# Altium schematic sheet P04_BCS1_Core Connector.SchDoc
size A3; Date: 24.11.2011; CheckedBy: Finke; Author: Mierau; DrawnBy: Mierau; SheetNumber: 4; SheetTotal: 8; Anlage: 78; Beschreibung: Qseven; Kunde: 56; ProjektName: BCS1; ProjektNummer: 88xxx; Ersatz_fuer: 12; ersetzt_durch: 34; LKNummer: 6190202; ID_Nummer: 90
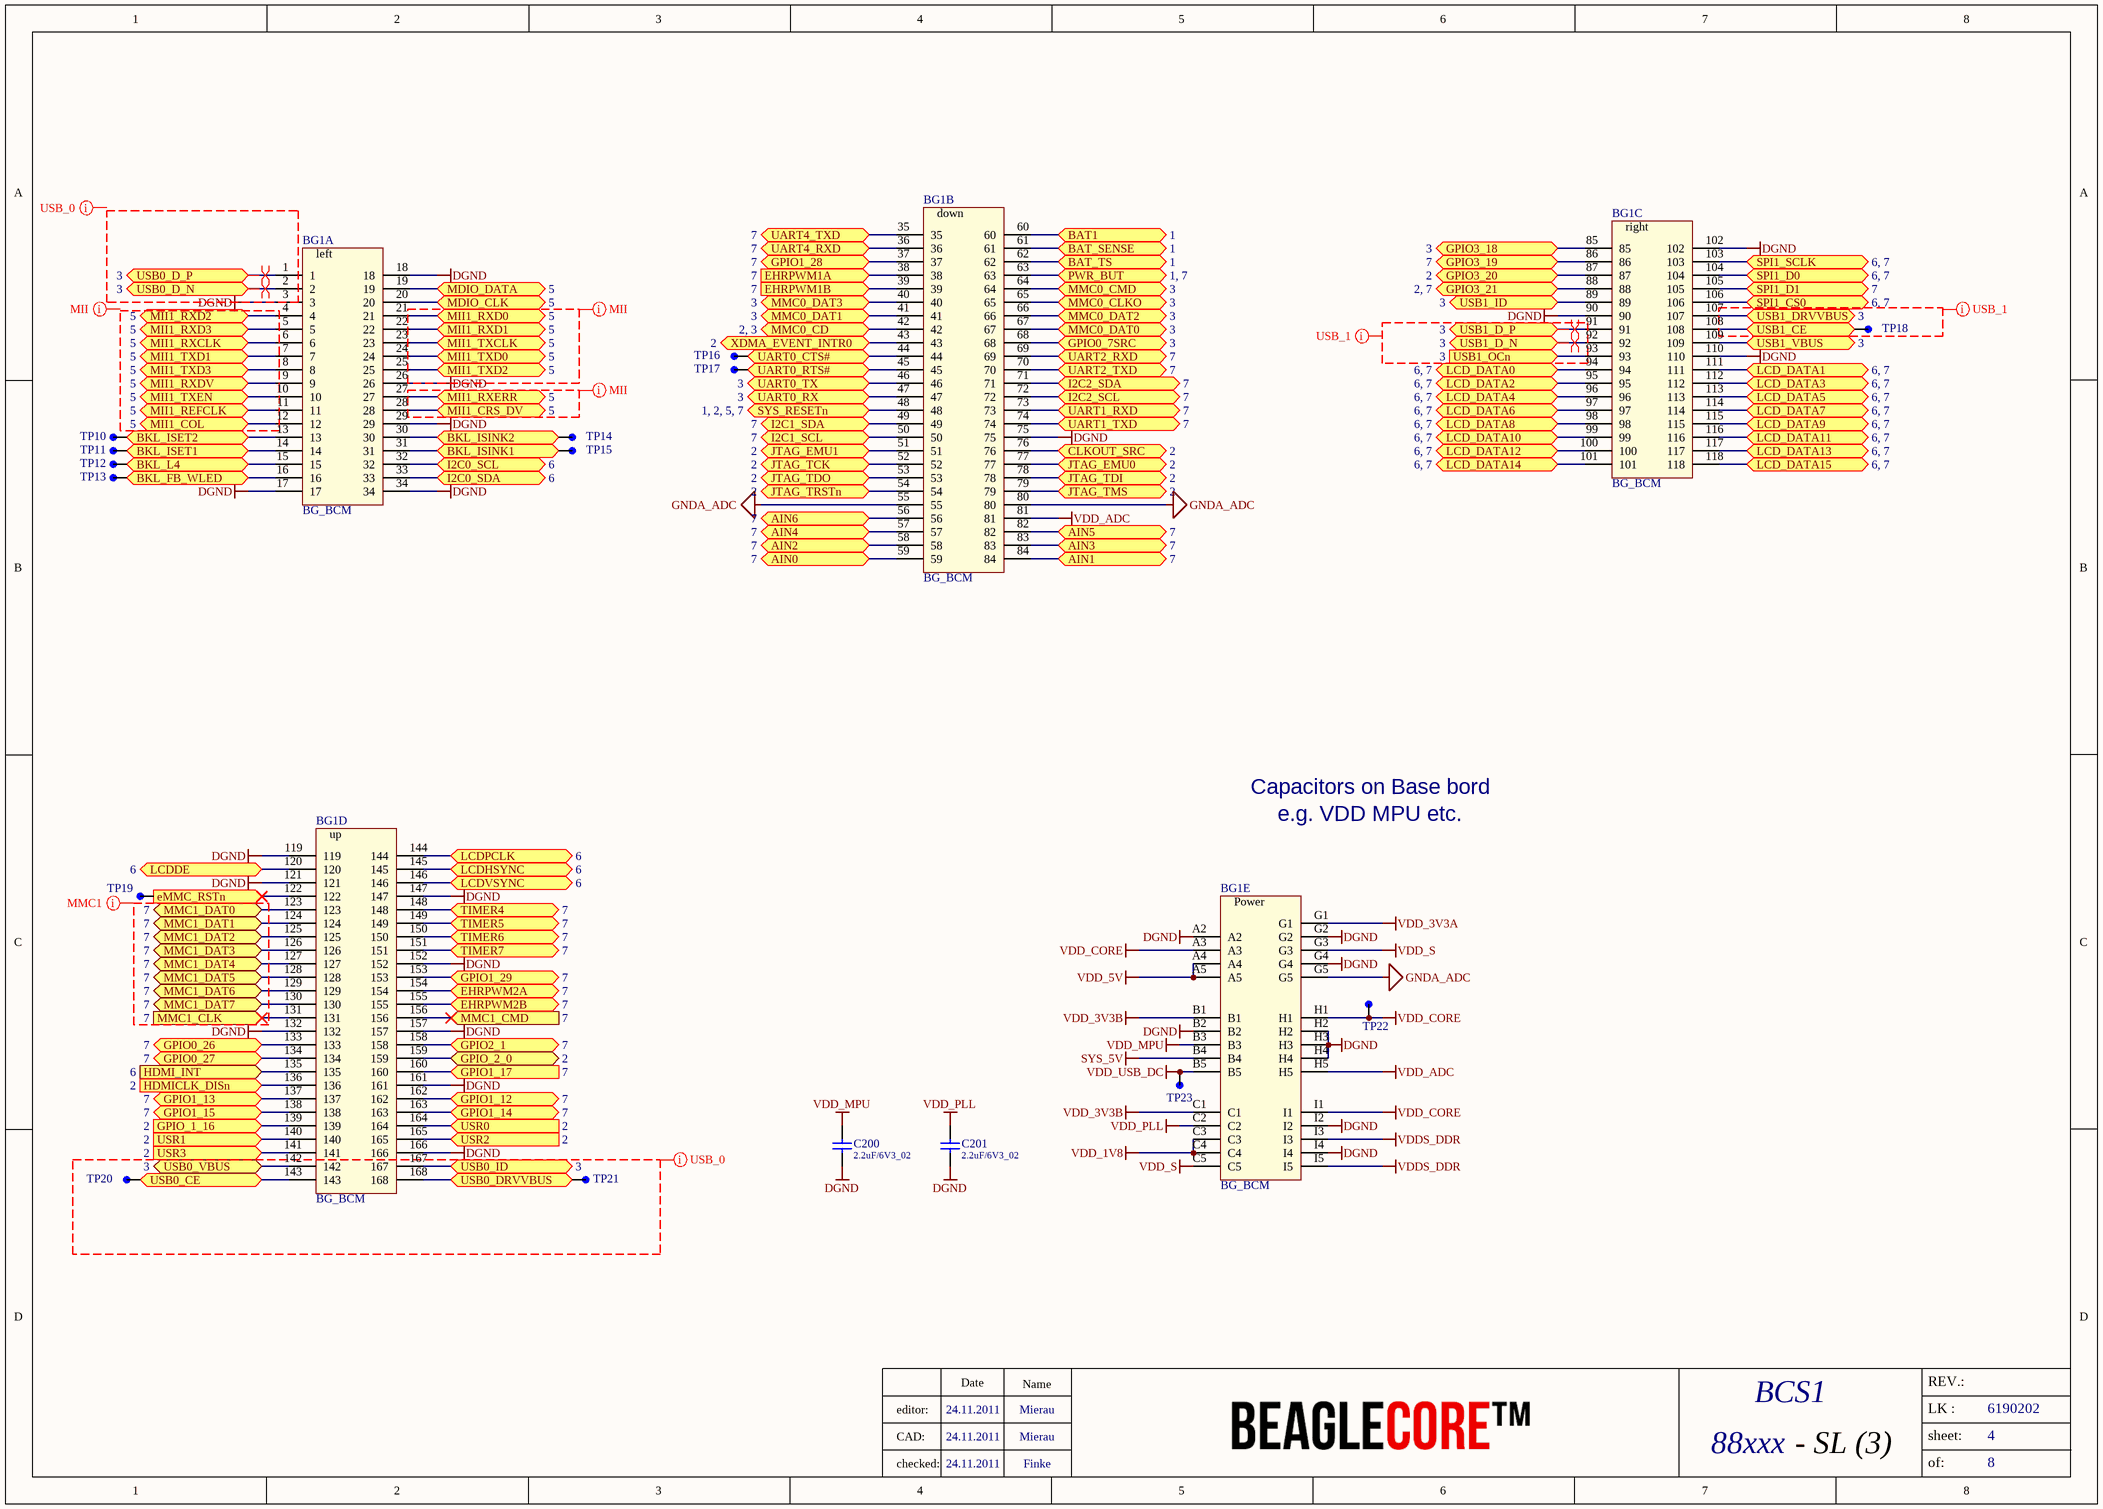
[diagram p0: P04_BCS1_Core Connector.SchDoc]

## Parts
BG1  BG_BCM  [BG_BCM]  (parts A,B,C,D,E of 5)  (no BOM)
C200  2.2uF/6V3_02  [CC1005-0402]
C201  2.2uF/6V3_02  [CC1005-0402]
TP10  TP THT  [TP mit 0.8mm Bohrung]  (value not drawn)  (no BOM)
TP11  TP THT  [TP mit 0.8mm Bohrung]  (value not drawn)  (no BOM)
TP12  TP THT  [TP mit 0.8mm Bohrung]  (value not drawn)  (no BOM)
TP13  TP THT  [TP mit 0.8mm Bohrung]  (value not drawn)  (no BOM)
TP14  TP THT  [TP mit 0.8mm Bohrung]  (value not drawn)  (no BOM)
TP15  TP THT  [TP mit 0.8mm Bohrung]  (value not drawn)  (no BOM)
TP16  TP THT  [TP mit 0.8mm Bohrung]  (value not drawn)  (no BOM)
TP17  TP THT  [TP mit 0.8mm Bohrung]  (value not drawn)  (no BOM)
TP18  TP THT  [TP mit 0.8mm Bohrung]  (value not drawn)  (no BOM)
TP19  TP THT  [TP mit 0.8mm Bohrung]  (value not drawn)  (no BOM)
TP20  TP THT  [TP mit 0.8mm Bohrung]  (value not drawn)  (no BOM)
TP21  TP THT  [TP mit 0.8mm Bohrung]  (value not drawn)  (no BOM)
TP22  TP THT  [TP mit 0.8mm Bohrung]  (value not drawn)  (no BOM)
TP23  TP THT  [TP mit 0.8mm Bohrung]  (value not drawn)  (no BOM)

## Ports
AIN0 (see 7), AIN1 (see 7), AIN2 (see 7), AIN3 (see 7), AIN4 (see 7), AIN5 (see 7), AIN6 (see 7), BAT1 (see 1), BAT_SENSE (see 1), BAT_TS (see 1), BKL_FB_WLED (bidir), BKL_ISET1 (bidir), BKL_ISET2 (bidir), BKL_ISINK1 (bidir), BKL_ISINK2 (bidir), BKL_L4 (bidir), CLKOUT_SRC (bidir, see 2), EHRPWM1A (in, see 7), EHRPWM1B (in, see 7), EHRPWM2A (bidir, see 7), EHRPWM2B (bidir, see 7), eMMC_RSTn (in), GPIO0_7SRC (bidir, see 3), GPIO0_26 (bidir, see 7), GPIO0_27 (bidir, see 7), GPIO1_12 (bidir, see 7), GPIO1_13 (bidir, see 7), GPIO1_14 (bidir, see 7), GPIO1_15 (bidir, see 7), GPIO1_17 (in, see 7), GPIO1_28 (bidir, see 7), GPIO1_29 (bidir, see 7), GPIO2_1 (bidir, see 7), GPIO3_18 (bidir, see 3), GPIO3_19 (bidir, see 7), GPIO3_20 (bidir, see 2), GPIO3_21 (bidir, see 2, 7), GPIO_1_16 (in, see 2), GPIO_2_0 (bidir, see 2), HDMI_INT (in, see 6), HDMICLK_DISn (in, see 2), I2C0_SCL (bidir, see 6), I2C0_SDA (bidir, see 6), I2C1_SCL (bidir, see 7), I2C1_SDA (bidir, see 7), I2C2_SCL (bidir, see 7), I2C2_SDA (bidir, see 7), JTAG_EMU0 (see 2), JTAG_EMU1 (see 2), JTAG_TCK (see 2), JTAG_TDI (see 2), JTAG_TDO (see 2), JTAG_TMS (see 2), JTAG_TRSTn (see 2), LCD_DATA0 (bidir, see 6, 7), LCD_DATA1 (bidir, see 6, 7), LCD_DATA2 (bidir, see 6, 7), LCD_DATA3 (bidir, see 6, 7), LCD_DATA4 (bidir, see 6, 7), LCD_DATA5 (bidir, see 6, 7), LCD_DATA6 (bidir, see 6, 7), LCD_DATA7 (bidir, see 6, 7), LCD_DATA8 (bidir, see 6, 7), LCD_DATA9 (bidir, see 6, 7), LCD_DATA10 (bidir, see 6, 7), LCD_DATA11 (bidir, see 6, 7), LCD_DATA12 (bidir, see 6, 7), LCD_DATA13 (bidir, see 6, 7), LCD_DATA14 (bidir, see 6, 7), LCD_DATA15 (bidir, see 6, 7), LCDDE (bidir, see 6), LCDHSYNC (bidir, see 6), LCDPCLK (bidir, see 6), LCDVSYNC (bidir, see 6), MDIO_CLK (bidir, see 5), MDIO_DATA (bidir, see 5), MII1_COL (bidir, see 5), MII1_CRS_DV (bidir, see 5), MII1_REFCLK (bidir, see 5), MII1_RXCLK (bidir, see 5), MII1_RXD0 (bidir, see 5), MII1_RXD1 (bidir, see 5), MII1_RXD2 (bidir, see 5), MII1_RXD3 (bidir, see 5), MII1_RXDV (bidir, see 5), MII1_RXERR (bidir, see 5), MII1_TXCLK (bidir, see 5), MII1_TXD0 (bidir, see 5), MII1_TXD1 (bidir, see 5), MII1_TXD2 (bidir, see 5), MII1_TXD3 (bidir, see 5), MII1_TXEN (bidir, see 5), MMC0_CD (bidir, see 2, 3), MMC0_CLKO (bidir, see 3), MMC0_CMD (bidir, see 3), MMC0_DAT0 (bidir, see 3), MMC0_DAT1 (bidir, see 3), MMC0_DAT2 (bidir, see 3), MMC0_DAT3 (bidir, see 3), MMC1_CLK (in, see 7), MMC1_CMD (in, see 7), MMC1_DAT0 (bidir, see 7), MMC1_DAT1 (bidir, see 7), MMC1_DAT2 (bidir, see 7), MMC1_DAT3 (bidir, see 7), MMC1_DAT4 (bidir, see 7), MMC1_DAT5 (bidir, see 7), MMC1_DAT6 (bidir, see 7), MMC1_DAT7 (bidir, see 7), PWR_BUT (see 1, 7), SPI1_CS0 (bidir, see 6, 7), SPI1_D0 (bidir, see 6, 7), SPI1_D1 (bidir, see 7), SPI1_SCLK (bidir, see 6, 7), SYS_RESETn (bidir, see 1, 2, 5, 7), TIMER4 (bidir, see 7), TIMER5 (bidir, see 7), TIMER6 (bidir, see 7), TIMER7 (bidir, see 7), UART0_CTS# (bidir), UART0_RTS# (bidir), UART0_RX (see 3), UART0_TX (bidir, see 3), UART1_RXD (bidir, see 7), UART1_TXD (bidir, see 7), UART2_RXD (bidir, see 7), UART2_TXD (bidir, see 7), UART4_RXD (bidir, see 7), UART4_TXD (see 7), USB0_CE, USB0_D_N (bidir, see 3), USB0_D_P (bidir, see 3), USB0_DRVVBUS, USB0_ID (see 3), USB0_VBUS (see 3), USB1_CE, USB1_D_N (bidir, see 3), USB1_D_P (bidir, see 3), USB1_DRVVBUS (see 3), USB1_ID (see 3), USB1_OCn (in, see 3), USB1_VBUS (see 3), USR0 (in, see 2), USR1 (in, see 2), USR2 (in, see 2), USR3 (in, see 2), XDMA_EVENT_INTR0 (bidir, see 2)

## Nets
DGND: BG1.3 BG1.17 BG1.18 BG1.26 BG1.29 BG1.34 BG1.75 BG1.90 BG1.102 BG1.110 BG1.119 BG1.121 BG1.132 BG1.147 BG1.152 BG1.157 BG1.161 BG1.166 BG1.A2 BG1.B2 BG1.G2 BG1.G4 BG1.H2 BG1.H3 BG1.H4 BG1.I2 BG1.I4 C200.1 C201.1
GNDA_ADC: BG1.55 BG1.80 BG1.G5
SYS_5V: BG1.B4
VDD_1V8: BG1.C3 BG1.C4
VDD_3V3A: BG1.G1
VDD_3V3B: BG1.B1 BG1.C1
VDD_5V: BG1.A4 BG1.A5
VDD_ADC: BG1.81 BG1.H5
VDD_CORE: BG1.A3 BG1.H1 BG1.I1 TP22.1(Pin)
VDD_MPU: BG1.B3 C200.2
VDD_PLL: BG1.C2 C201.2
VDD_S: BG1.C5 BG1.G3
VDD_USB_DC: BG1.B5 TP23.1(Pin)
VDDS_DDR: BG1.I3 BG1.I5
AIN0: BG1.59 ; port AIN0
AIN1: BG1.84 ; port AIN1
AIN2: BG1.58 ; port AIN2
AIN3: BG1.83 ; port AIN3
AIN4: BG1.57 ; port AIN4
AIN5: BG1.82 ; port AIN5
AIN6: BG1.56 ; port AIN6
BAT1: BG1.60 ; port BAT1
BAT_SENSE: BG1.61 ; port BAT_SENSE
BAT_TS: BG1.62 ; port BAT_TS
BKL_FB_WLED: BG1.16 TP13.1(Pin) ; port BKL_FB_WLED
BKL_ISET1: BG1.14 TP11.1(Pin) ; port BKL_ISET1
BKL_ISET2: BG1.13 TP10.1(Pin) ; port BKL_ISET2
BKL_ISINK1: BG1.31 TP15.1(Pin) ; port BKL_ISINK1
BKL_ISINK2: BG1.30 TP14.1(Pin) ; port BKL_ISINK2
BKL_L4: BG1.15 TP12.1(Pin) ; port BKL_L4
CLKOUT_SRC: BG1.76 ; port CLKOUT_SRC
EHRPWM1A: BG1.38 ; port EHRPWM1A
EHRPWM1B: BG1.39 ; port EHRPWM1B
EHRPWM2A: BG1.154 ; port EHRPWM2A
EHRPWM2B: BG1.155 ; port EHRPWM2B
eMMC_RSTn: BG1.122 TP19.1(Pin) ; port eMMC_RSTn
GPIO0_7SRC: BG1.68 ; port GPIO0_7SRC
GPIO0_26: BG1.133 ; port GPIO0_26
GPIO0_27: BG1.134 ; port GPIO0_27
GPIO1_12: BG1.162 ; port GPIO1_12
GPIO1_13: BG1.137 ; port GPIO1_13
GPIO1_14: BG1.163 ; port GPIO1_14
GPIO1_15: BG1.138 ; port GPIO1_15
GPIO1_17: BG1.160 ; port GPIO1_17
GPIO1_28: BG1.37 ; port GPIO1_28
GPIO1_29: BG1.153 ; port GPIO1_29
GPIO2_1: BG1.158 ; port GPIO2_1
GPIO3_18: BG1.85 ; port GPIO3_18
GPIO3_19: BG1.86 ; port GPIO3_19
GPIO3_20: BG1.87 ; port GPIO3_20
GPIO3_21: BG1.88 ; port GPIO3_21
GPIO_1_16: BG1.139 ; port GPIO_1_16
GPIO_2_0: BG1.159 ; port GPIO_2_0
HDMI_INT: BG1.135 ; port HDMI_INT
HDMICLK_DISn: BG1.136 ; port HDMICLK_DISn
I2C0_SCL: BG1.32 ; port I2C0_SCL
I2C0_SDA: BG1.33 ; port I2C0_SDA
I2C1_SCL: BG1.50 ; port I2C1_SCL
I2C1_SDA: BG1.49 ; port I2C1_SDA
I2C2_SCL: BG1.72 ; port I2C2_SCL
I2C2_SDA: BG1.71 ; port I2C2_SDA
JTAG_EMU0: BG1.77 ; port JTAG_EMU0
JTAG_EMU1: BG1.51 ; port JTAG_EMU1
JTAG_TCK: BG1.52 ; port JTAG_TCK
JTAG_TDI: BG1.78 ; port JTAG_TDI
JTAG_TDO: BG1.53 ; port JTAG_TDO
JTAG_TMS: BG1.79 ; port JTAG_TMS
JTAG_TRSTn: BG1.54 ; port JTAG_TRSTn
LCD_DATA0: BG1.94 ; port LCD_DATA0
LCD_DATA1: BG1.111 ; port LCD_DATA1
LCD_DATA2: BG1.95 ; port LCD_DATA2
LCD_DATA3: BG1.112 ; port LCD_DATA3
LCD_DATA4: BG1.96 ; port LCD_DATA4
LCD_DATA5: BG1.113 ; port LCD_DATA5
LCD_DATA6: BG1.97 ; port LCD_DATA6
LCD_DATA7: BG1.114 ; port LCD_DATA7
LCD_DATA8: BG1.98 ; port LCD_DATA8
LCD_DATA9: BG1.115 ; port LCD_DATA9
LCD_DATA10: BG1.99 ; port LCD_DATA10
LCD_DATA11: BG1.116 ; port LCD_DATA11
LCD_DATA12: BG1.100 ; port LCD_DATA12
LCD_DATA13: BG1.117 ; port LCD_DATA13
LCD_DATA14: BG1.101 ; port LCD_DATA14
LCD_DATA15: BG1.118 ; port LCD_DATA15
LCDDE: BG1.120 ; port LCDDE
LCDHSYNC: BG1.145 ; port LCDHSYNC
LCDPCLK: BG1.144 ; port LCDPCLK
LCDVSYNC: BG1.146 ; port LCDVSYNC
MDIO_CLK: BG1.20 ; port MDIO_CLK
MDIO_DATA: BG1.19 ; port MDIO_DATA
MII1_COL: BG1.12 ; port MII1_COL
MII1_CRS_DV: BG1.28 ; port MII1_CRS_DV
MII1_REFCLK: BG1.11 ; port MII1_REFCLK
MII1_RXCLK: BG1.6 ; port MII1_RXCLK
MII1_RXD0: BG1.21 ; port MII1_RXD0
MII1_RXD1: BG1.22 ; port MII1_RXD1
MII1_RXD2: BG1.4 ; port MII1_RXD2
MII1_RXD3: BG1.5 ; port MII1_RXD3
MII1_RXDV: BG1.9 ; port MII1_RXDV
MII1_RXERR: BG1.27 ; port MII1_RXERR
MII1_TXCLK: BG1.23 ; port MII1_TXCLK
MII1_TXD0: BG1.24 ; port MII1_TXD0
MII1_TXD1: BG1.7 ; port MII1_TXD1
MII1_TXD2: BG1.25 ; port MII1_TXD2
MII1_TXD3: BG1.8 ; port MII1_TXD3
MII1_TXEN: BG1.10 ; port MII1_TXEN
MMC0_CD: BG1.42 ; port MMC0_CD
MMC0_CLKO: BG1.65 ; port MMC0_CLKO
MMC0_CMD: BG1.64 ; port MMC0_CMD
MMC0_DAT0: BG1.67 ; port MMC0_DAT0
MMC0_DAT1: BG1.41 ; port MMC0_DAT1
MMC0_DAT2: BG1.66 ; port MMC0_DAT2
MMC0_DAT3: BG1.40 ; port MMC0_DAT3
MMC1_CLK: BG1.131 ; port MMC1_CLK
MMC1_CMD: BG1.156 ; port MMC1_CMD
MMC1_DAT0: BG1.123 ; port MMC1_DAT0
MMC1_DAT1: BG1.124 ; port MMC1_DAT1
MMC1_DAT2: BG1.125 ; port MMC1_DAT2
MMC1_DAT3: BG1.126 ; port MMC1_DAT3
MMC1_DAT4: BG1.127 ; port MMC1_DAT4
MMC1_DAT5: BG1.128 ; port MMC1_DAT5
MMC1_DAT6: BG1.129 ; port MMC1_DAT6
MMC1_DAT7: BG1.130 ; port MMC1_DAT7
PWR_BUT: BG1.63 ; port PWR_BUT
SPI1_CS0: BG1.106 ; port SPI1_CS0
SPI1_D0: BG1.104 ; port SPI1_D0
SPI1_D1: BG1.105 ; port SPI1_D1
SPI1_SCLK: BG1.103 ; port SPI1_SCLK
SYS_RESETn: BG1.48 ; port SYS_RESETn
TIMER4: BG1.148 ; port TIMER4
TIMER5: BG1.149 ; port TIMER5
TIMER6: BG1.150 ; port TIMER6
TIMER7: BG1.151 ; port TIMER7
UART0_CTS#: BG1.44 TP16.1(Pin) ; port UART0_CTS#
UART0_RTS#: BG1.45 TP17.1(Pin) ; port UART0_RTS#
UART0_RX: BG1.47 ; port UART0_RX
UART0_TX: BG1.46 ; port UART0_TX
UART1_RXD: BG1.73 ; port UART1_RXD
UART1_TXD: BG1.74 ; port UART1_TXD
UART2_RXD: BG1.69 ; port UART2_RXD
UART2_TXD: BG1.70 ; port UART2_TXD
UART4_RXD: BG1.36 ; port UART4_RXD
UART4_TXD: BG1.35 ; port UART4_TXD
USB0_CE: BG1.143 TP20.1(Pin) ; port USB0_CE
USB0_D_N: BG1.2 ; port USB0_D_N
USB0_D_P: BG1.1 ; port USB0_D_P
USB0_DRVVBUS: BG1.168 TP21.1(Pin) ; port USB0_DRVVBUS
USB0_ID: BG1.167 ; port USB0_ID
USB0_VBUS: BG1.142 ; port USB0_VBUS
USB1_CE: BG1.108 TP18.1(Pin) ; port USB1_CE
USB1_D_N: BG1.92 ; port USB1_D_N
USB1_D_P: BG1.91 ; port USB1_D_P
USB1_DRVVBUS: BG1.107 ; port USB1_DRVVBUS
USB1_ID: BG1.89 ; port USB1_ID
USB1_OCn: BG1.93 ; port USB1_OCn
USB1_VBUS: BG1.109 ; port USB1_VBUS
USR0: BG1.164 ; port USR0
USR1: BG1.140 ; port USR1
USR2: BG1.165 ; port USR2
USR3: BG1.141 ; port USR3
XDMA_EVENT_INTR0: BG1.43 ; port XDMA_EVENT_INTR0

## Layout directives
differential pair: USB0_D_N, USB0_D_P, USB1_D_N, USB1_D_P
net class MMC1: (no net found under the mark)
net class USB_0: (no net found under the mark)
net class USB_1: (no net found under the mark)
net class MII: (no net found under the mark), DGND

## Notes on the sheet
- Capacitors on Base bord
- e.g. VDD MPU etc.
- Date
- Name
- REV.:
- editor:
- CAD:
- - SL (3)
- sheet:
- LK :
- checked:
- of:
- (in symbol BG_BCM, part A) left
- (in symbol BG_BCM, part B) down
- (in symbol BG_BCM, part C) right
- (in symbol BG_BCM, part D) up
- (in symbol BG_BCM, part E) Power

## Library data of the parts
BG1 = BG_BCM: Beaglecore; Value: BG_BCM
C200 C201 = C2.2uF/6V3_02: Capacitor 0402;  6V3;  X5R; Value: 2.2uF/6V3_02
TP10-TP18 TP20-TP23 = TP1.6 mit Bohrung 0.8: Testpunkt rund mit Bohrung D=0.8mm; Value: TP THT
TP19 = TP1.6 mit Bohrung 0.8: Testpunkt rund mit Bohrung D=0.8mm; S/T: mech; erstellt von: Finke; Published: 24-Mar-1999; Art Nr.: *; Value: TP THT